# Altium schematic sheet RF.SchDoc
size A
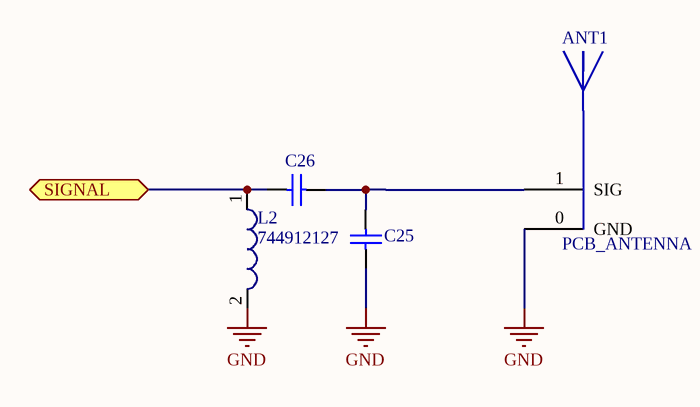
[diagram p0: RF.SchDoc]

## Parts
ANT1  PCB_ANTENNA  [2.4GHZ_ANTENNA]
C25  CAP 2.4pF 100V 0603(1608)  [CAPC0603(1608)100_M]  (value not drawn)
C26  CAP 3.9pF 100V 0603(1608)  [CAPC0603(1608)100_M]  (value not drawn)
L2  744912127  [WE-CAIR_4248]

## Ports
SIGNAL (bidir)

## Nets
GND: ANT1.0(GND) C25.1 L2.2
SIGNAL: C26.1 L2.1 ; port SIGNAL
NetANT1_1: ANT1.1(SIG) C25.2 C26.2

## Library data of the parts
C25 = CMP-1035-00176-1: CAP 2.4pF 100V ±0.25pF 0603 (1608 Metric) Thickness 1mm SMD; Tolerance: Â±0.25pF; Case-EIA: 0603; Case-Metric: 1608; Rated Voltage: 100 V; Max Thickness: 1 mm; Value: 2.4pF; Technology: SMT
C26 = CMP-1035-00286-1: CAP 3.9pF 100V ±0.1pF 0603 (1608 Metric) Thickness 1mm SMD; Case-Metric: 1608; Case-EIA: 0603; Tolerance: Â±0.1pF; Max Thickness: 1 mm; Technology: SMT; Rated Voltage: 100 V; Value: 3.9pF
L2 = CMP-1497-00015-1: WE-CAIR Air Coil, L=27 nH; Manufacturer: Wuerth Elektronik; Inductance: 27 nH; ComponentLink2URL: http://katalog.we-online.de/kataloge/eisos/media/pdf/744912127.pdf; ComponentLink2Description: Datasheet; PartNumber: 744912127; PackageReference: WE-CAIR_4248; ComponentLink1URL: http://www.we-online.com; ComponentLink1Description: Manufacturer URL